# Altium schematic sheet ac_dc_converter.SchDoc
size 297 x 209 mm; DrawnBy: Supun; Engineer: Supun; Organization: C3
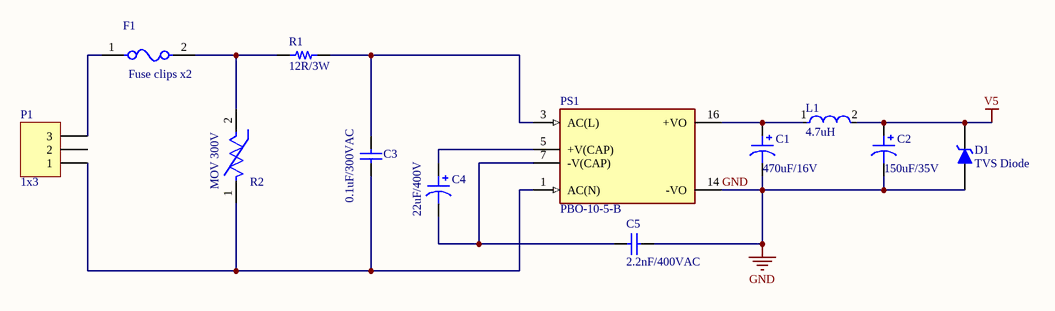
[diagram p0: ac_dc_converter.SchDoc]

## Parts
C1  470uF/16V  [CAP TH ALPOLY D8.00mm S3.50mm H12.00mm]
C2  150uF/35V  [CAP TH ALPOLY D8.00mm S3.50mm H12.00mm]
C3  0.1uF/300VAC  [WCAP-FTX2_L13W7H13]
C4  22uF/400V  [CAP AL TH D16 L7.5 H20]
C5  2.2nF/400VAC  [CAP TH SAFTY D7.00MM S7.50MM H11.00MM]
D1  TVS Diode  [Vishay_SMBJ7.0A]
F1  Fuse clips x2  [5mm x 20mm fuse block]
L1  4.7uH  [IND RADIAL D8.70MM S5.00MM H12.50MM]
P1  1x3  [Molex_NanoFit_1x3]
PS1  PBO-10-5-B  [CONV_PBO-10-5-B]
R1  12R/3W  [R2W_AX_VER]
R2  MOV 300V  [EPCOS_0_0]

## Nets
GND: C1.2 C2.2 C5.2 D1.2(A) PS1.14(-VO)
V5: C2.1 D1.1(C) L1.2
NetC1_1: C1.1 L1.1 PS1.16(+VO)
NetC3_1: C3.1 P1.1 PS1.1(AC(N)) R2.1
NetC3_2: C3.2 PS1.3(AC(L)) R1.2
NetC4_1: C4.1 PS1.5(+V(CAP))
NetC4_2: C4.2 C5.1 PS1.7(-V(CAP))
NetF1_1: F1.1 P1.3
NetF1_2: F1.2 R1.1 R2.2

Not connected (* = marked no-connect by the designer): P1 2

## Notes on the sheet
- Title
- Size:
- Date:
- A4
- Number:
- Time:
- Revision:
- Sheet
- of
- File:

## Library data of the parts
C1 = Polarised Capacitor: SMT Polarised Capacitor; MF: Panasonic; MP: ECA-1CM471B; Value: 470uF/16V; Link: https://
C2 = Polarised Capacitor: SMT Polarised Capacitor; MF: Wurth; MP: 860040574005; Value: 150uF/35V; Link: https://
C3 = Safety Capacitor: WCAP-FTX2 Film Capacitor, THT, L13W7H13; Insulation Resistance: 30000MOhm; MF: Wurth; Dissipation Factor@100kHz: 0.5%; MP: 890324023023; Capacitance: 100nF; Dissipation Factor@1kHz: 0.1%; Rated Voltage: 275VAC; Rate of Voltage Rise: 300V/us; Pitch: 10mm; Technical Reference: MX2P010104K275ASPB16000; Capacitance Tolerance: +/-10%; ComponentLink1Description: Manufacturer; ComponentLink1URL: http://www.we-online.de; ComponentLink2Description: Datasheet; ComponentLink2URL: https://www.we-online.com/catalog/datasheet/890324023023.pdf; Length: 13mm; Mounting Technology: THT; Operating Temperature: -40 to +105degC; Width: 7mm; Dissipation Factor@10kHz: 0.1%; Height: 13mm; Packaging: Carton; Published Date: May 2020; Value: 0.1uF/300VAC; Link: https://
C4 = Polarised Capacitor: SMT Polarised Capacitor; MF: Nichicon; MP: UCA2G220MHD6; Value: 22uF/400V; Link: https://
C5 = Safety Capacitor: WCAP-FTX2 Film Capacitor, THT, L13W7H13; Insulation Resistance: 30000MOhm; MF: KEMET; Dissipation Factor@100kHz: 0.5%; MP: C907U222MYVDBA7317; Capacitance: 100nF; Dissipation Factor@1kHz: 0.1%; Rated Voltage: 275VAC; Rate of Voltage Rise: 300V/us; Pitch: 10mm; Technical Reference: MX2P010104K275ASPB16000; Capacitance Tolerance: +/-10%; ComponentLink1Description: Manufacturer; ComponentLink1URL: http://www.we-online.de; ComponentLink2Description: Datasheet; ComponentLink2URL: https://www.we-online.com/catalog/datasheet/890324023023.pdf; Length: 13mm; Mounting Technology: THT; Operating Temperature: -40 to +105degC; Width: 7mm; Dissipation Factor@10kHz: 0.1%; Height: 13mm; Packaging: Carton; Published Date: May 2020; Value: 2.2nF/400VAC; Link: https://
D1 = TVS Diode 1ch uni: MF: Vishay; MP: SMBJ7.0A-E3/52; Value: 7A; Link: https://
F1 = Fuse Block: FUSE BLOCK CART 250V 6.3A PCB 5mm x 20mm; MP: 3512; MF: Keystone; helpURL: https://upverter.com/upn/revision/2502ba824e7f420c/; ComponentLink2Description: Datasheet; Temperature: to; Package: PTH_FUSE_5MM0_20MM0; Supplier 2: Mouser; Supplier 1: Digi-Key; ComponentLink1URL: https://upverter.com/upn/revision/2502ba824e7f420c/; Voltage: 250V; ComponentLink1Description: Upverter; ComponentLink2URL: http://www.littelfuse.com/~/media/electronics/datasheets/fuse_blocks/littelfuse_fuse_block_646_datasheet.pdf.pdf; RoHS: TRUE; Current Rating: 6.3A; Digikey Description: FUSE BLOCK CART 250V 6.3A PCB; Digikey Part Number: WK6244-ND; Lead Free: yes; Value: Fuse clips x2; Link: https://
L1 = Inductor_sm: Fixed Inductors 2.2uH 20% High Temp AEC-Q200; MF: Bourns; MP: RLB0913-4R7K; Value: 4.7uH; Link: https://
P1 = Header 3H: Header, 3-Pin, Right Angle; MF: Molex; MP: 105313-2103; LatestRevisionDate: 17-Jul-2002; LatestRevisionNote: Re-released for DXP Platform.; Publisher: Altium Limited; Value: 1x3; Link: https://
PS1 = PBO-10-5-B: AC/DC Power Modules 5 Vdc, 2 A, 10 W; MF: CUI Inc.; Price: None; MP: PBO-10-5-B; Package: None; Availability: Unavailable; Value: *; Link: https://
R1 = Resistor: THT Resistor; MF: Yageo; MP: RSF3WSJT-73-12R; Value: 12R/3W; Link: https://
R2 = varistors: MF: TDK; MP: B72214S0301K101; Value: MOV 300V; Link: https://